# EasyEDA schematic SCH_数字时钟_2022-10-11.json
TITLE: Sheet_1; REV: 1.0; Date: 2022-10-07; Sheet: 1/1; Drawn By: 12sfdsg; Company: Your Company
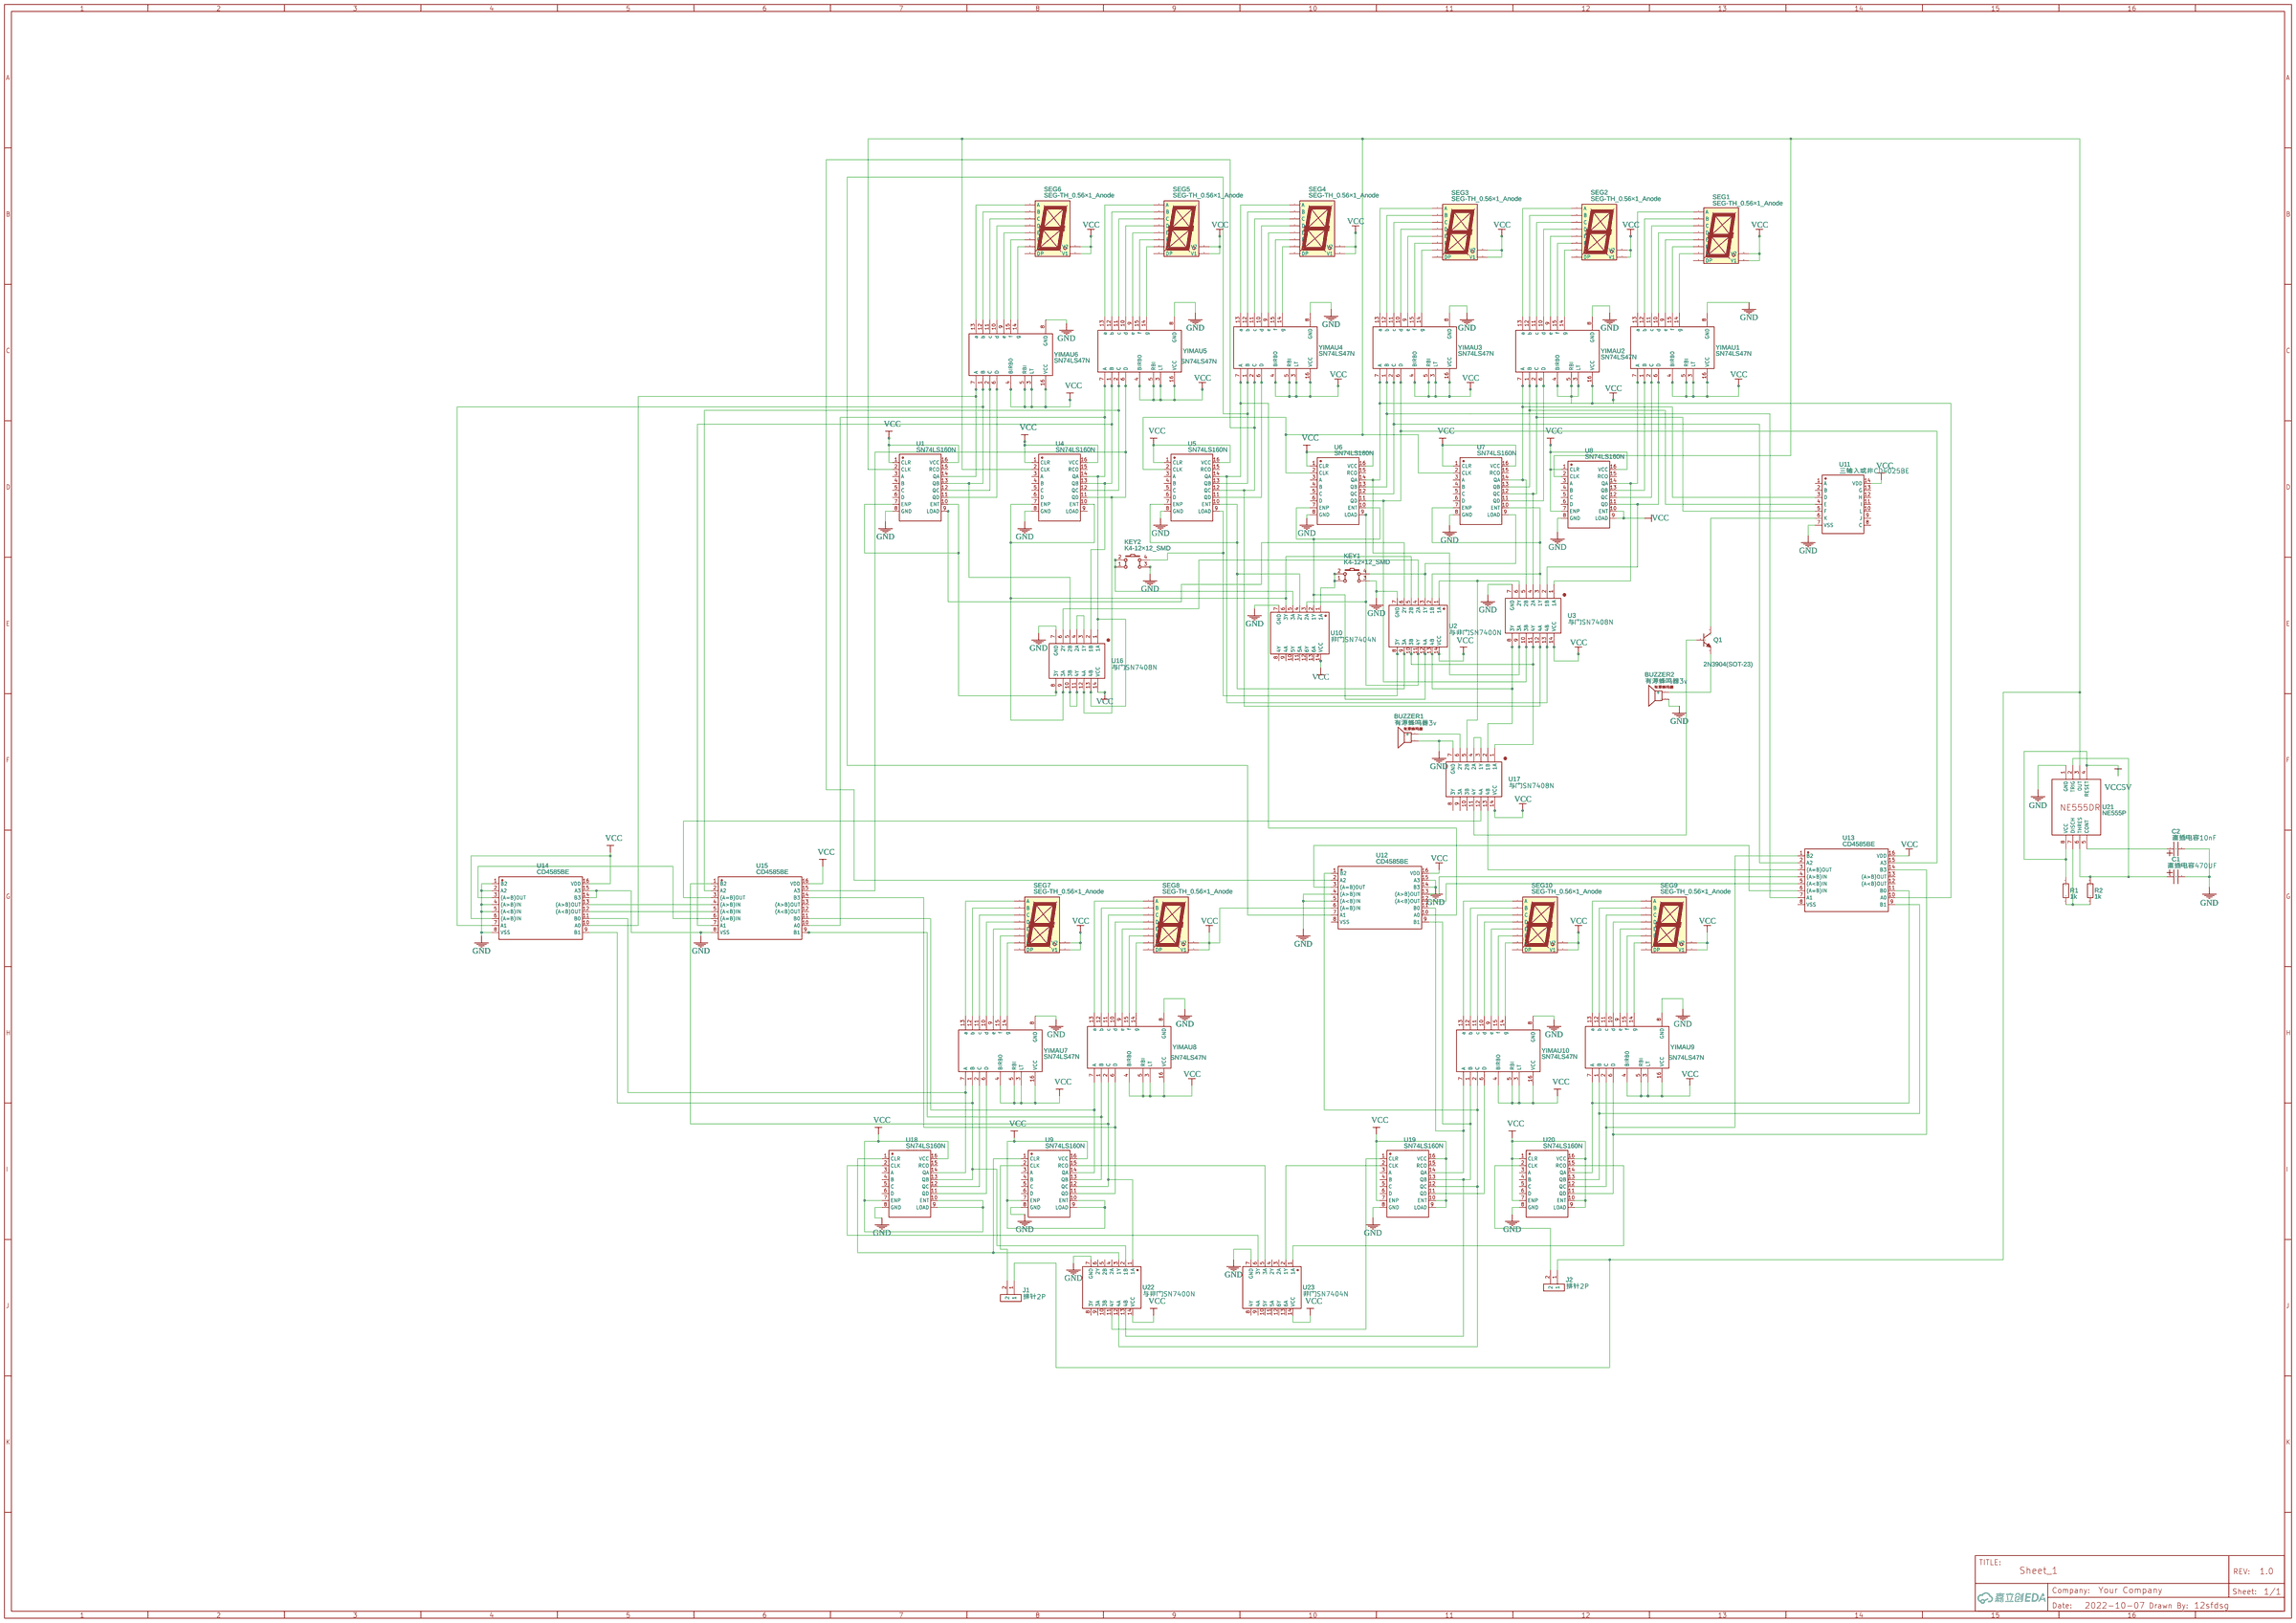
[diagram p0: schematic sheet]

## Parts
BUZZER1  有源蜂鸣器3v  [有源蜂鸣器3V]
BUZZER2  有源蜂鸣器3v  [有源蜂鸣器3V]
C1  直插电容470UF  [直插电容470UF]
C2  直插电容10nF  [直插电容470UF]
J1  排针2P  [排针2P]
J2  排针2P  [排针2P]
KEY1  K4-12×12_SMD  [KEY-SMD_4P-L12.0-W12.0-P5.00-LS15.2]
KEY2  K4-12×12_SMD  [KEY-SMD_4P-L12.0-W12.0-P5.00-LS15.2]
Q1  2N3904(SOT-23)  [SOT-23-3_L2.9-W1.3-P1.90-LS2.4-TR]
R1  1k  [直插电阻]
R2  1k  [直插电阻]
SEG1  SEG-TH_0.56×1_Anode  [LED-SEG-TH_10P-L12.6-W19.0-P2.54-S15.24-BL]
SEG2  SEG-TH_0.56×1_Anode  [LED-SEG-TH_10P-L12.6-W19.0-P2.54-S15.24-BL]
SEG3  SEG-TH_0.56×1_Anode  [LED-SEG-TH_10P-L12.6-W19.0-P2.54-S15.24-BL]
SEG4  SEG-TH_0.56×1_Anode  [LED-SEG-TH_10P-L12.6-W19.0-P2.54-S15.24-BL]
SEG5  SEG-TH_0.56×1_Anode  [LED-SEG-TH_10P-L12.6-W19.0-P2.54-S15.24-BL]
SEG6  SEG-TH_0.56×1_Anode  [LED-SEG-TH_10P-L12.6-W19.0-P2.54-S15.24-BL]
SEG7  SEG-TH_0.56×1_Anode  [LED-SEG-TH_10P-L12.6-W19.0-P2.54-S15.24-BL]
SEG8  SEG-TH_0.56×1_Anode  [LED-SEG-TH_10P-L12.6-W19.0-P2.54-S15.24-BL]
SEG9  SEG-TH_0.56×1_Anode  [LED-SEG-TH_10P-L12.6-W19.0-P2.54-S15.24-BL]
SEG10  SEG-TH_0.56×1_Anode  [LED-SEG-TH_10P-L12.6-W19.0-P2.54-S15.24-BL]
U1  SN74LS160N  [DIP-16]
U2  与非门SN7400N  [DIP14]
U3  与门SN7408N  [DIP14]
U4  SN74LS160N  [DIP-16]
U5  SN74LS160N  [DIP-16]
U6  SN74LS160N  [DIP-16]
U7  SN74LS160N  [DIP-16]
U8  SN74LS160N  [DIP-16]
U9  SN74LS160N  [DIP-16]
U10  非门SN7404N  [DIP14]
U11  三输入或非CD4025BE  [DIP-14_L19.2-W6.6-P2.54-LS10.9-BL]
U12  CD4585BE  [DIP-16_L20.0-W6.4-P2.54-LS7.6-BL]
U13  CD4585BE  [DIP-16_L20.0-W6.4-P2.54-LS7.6-BL]
U14  CD4585BE  [DIP-16_L20.0-W6.4-P2.54-LS7.6-BL]
U15  CD4585BE  [DIP-16_L20.0-W6.4-P2.54-LS7.6-BL]
U16  与门SN7408N  [DIP14]
U17  与门SN7408N  [DIP14]
U18  SN74LS160N  [DIP-16]
U19  SN74LS160N  [DIP-16]
U20  SN74LS160N  [DIP-16]
U21  NE555P  [NE555定时器]
U22  与非门SN7400N  [DIP14]
U23  非门SN7404N  [DIP14]
YIMAU1  SN74LS47N  [DIP-16]
YIMAU2  SN74LS47N  [DIP-16]
YIMAU3  SN74LS47N  [DIP-16]
YIMAU4  SN74LS47N  [DIP-16]
YIMAU5  SN74LS47N  [DIP-16]
YIMAU6  SN74LS47N  [DIP-16]
YIMAU7  SN74LS47N  [DIP-16]
YIMAU8  SN74LS47N  [DIP-16]
YIMAU9  SN74LS47N  [DIP-16]
YIMAU10  SN74LS47N  [DIP-16]

## Library data of the parts
BUZZER1 BUZZER2 = 有源蜂鸣器3v: Supplier: LCSC; Manufacturer: HNDZ; Manufacturer Part: TMB12A12; Supplier Part: C96079; Contributor: yibeikele
C1 C2 = 直插电容470UF: Contributor: 2021X
J1 J2 = 排针2P: Contributor: goodhello
KEY1 KEY2 = K4-12×12_SMD: Supplier Part: C136697; Supplier: LCSC; Manufacturer: 韩国韩荣; Manufacturer Part: K2-1103SP-E4SW-04; Contributor: LCEDA_Lib
Q1 = 2N3904(SOT-23): Supplier: LCSC; Manufacturer: KEC; Manufacturer Part: 2n3904S-RTK/PS; Supplier Part: C18536; Paste Type: SOT-23; Contributor: LCEDA_Lib
R1 R2 = 直插电阻: Supplier: LCSC; Manufacturer: UniOhm; Manufacturer Part: CFR0W4J0681A50; Supplier Part: C70784; Contributor: cy1811511104
SEG1-SEG10 = SEG-TH_0.56×1_Anode: Manufacturer: 志浩; Supplier Part: C8092; Supplier: LCSC; Contributor: LCEDA_01
U1 U4-U9 U18-U20 = SN74LS160N: Supplier: LCSC; Supplier Part: C113834; Manufacturer: YAGEO; Manufacturer Part: CC0805JRNPO9BN821; Contributor: LCSC
U2 U22 = SN7400N: Contributor: sky1001
U3 U16 U17 = SN7408N: Contributor: cdea
U10 U23 = SN7404N
U11 = CD4025BE: Supplier: LCSC; Manufacturer: TI; Supplier Part: C28214; JLCPCB Part Class: Extended Part
U12-U15 = CD4585BE: Supplier: LCSC; Manufacturer: TI; Supplier Part: C31466; JLCPCB Part Class: Extended Part
U21 = NE555P: Contributor: lzhlzh0805
YIMAU1-YIMAU10 = -: Supplier: LCSC; Manufacturer: TI; Contributor: LCSC; Supplier Part: C129379

## Nets
GND: BUZZER1.- BUZZER2.- C1.2 C2.2 KEY1.3 KEY2.3 U1.8(GND) U2.7(GND) U3.7(GND) U4.8(GND) U5.8(GND) U6.8(GND) U7.8(GND) U8.8(GND) U9.8(GND) U10.7(GND) U11.7(VSS) U12.4((A>B)IN) U12.5((A<B)IN) U12.14(B3) U12.15(A3) U14.1(B2) U14.2(A2) U14.4((A>B)IN) U14.5((A<B)IN) U14.8(VSS) U14.14(B3) U14.15(A3) U15.8(VSS) U16.7(GND) U17.7(GND) U18.8(GND) U19.8(GND) U20.8(GND) U21.1(GND) U22.7(GND) U23.7(GND) YIMAU1.8(GND) YIMAU2.8(GND) YIMAU3.8(GND) YIMAU4.8(GND) YIMAU5.8(GND) YIMAU6.8(GND) YIMAU7.8(GND) YIMAU8.8(GND) YIMAU9.8(GND) YIMAU10.8(GND)
VCC: SEG1.3(V1) SEG1.8(V2) SEG2.3(V1) SEG2.8(V2) SEG3.3(V1) SEG3.8(V2) SEG4.3(V1) SEG4.8(V2) SEG5.3(V1) SEG5.8(V2) SEG6.3(V1) SEG6.8(V2) SEG7.3(V1) SEG7.8(V2) SEG8.3(V1) SEG8.8(V2) SEG9.3(V1) SEG9.8(V2) SEG10.3(V1) SEG10.8(V2) U1.1(CLR) U1.16(VCC) U2.14(VCC) U3.9(3A) U3.14(VCC) U4.1(CLR) U4.16(VCC) U5.1(CLR) U5.16(VCC) U6.1(CLR) U6.14(QA) U6.16(VCC) U7.1(CLR) U7.16(VCC) U8.1(CLR) U8.7(ENP) U8.9(LOAD) U8.10(ENT) U8.16(VCC) U9.7(ENP) U9.9(LOAD) U9.10(ENT) U9.16(VCC) U10.14(VCC) U11.14(VDD) U12.6((A=B)IN) U12.16(VDD) U13.10(A0) U13.16(VDD) U14.6((A=B)IN) U14.16(VDD) U15.16(VDD) U16.14(VCC) U17.14(VCC) U18.7(ENP) U18.9(LOAD) U18.10(ENT) U18.16(VCC) U19.7(ENP) U19.9(LOAD) U19.10(ENT) U19.16(VCC) U20.1(CLR) U20.7(ENP) U20.9(LOAD) U20.10(ENT) U20.16(VCC) U22.14(VCC) U23.14(VCC) YIMAU1.3(LT) YIMAU1.4(BIRBO) YIMAU1.5(RBI) YIMAU1.16(VCC) YIMAU2.3(LT) YIMAU2.4(BIRBO) YIMAU2.5(RBI) YIMAU2.16(VCC) YIMAU3.3(LT) YIMAU3.4(BIRBO) YIMAU3.5(RBI) YIMAU3.7(A) YIMAU3.16(VCC) YIMAU4.3(LT) YIMAU4.4(BIRBO) YIMAU4.5(RBI) YIMAU4.16(VCC) YIMAU5.3(LT) YIMAU5.4(BIRBO) YIMAU5.5(RBI) YIMAU5.16(VCC) YIMAU6.3(LT) YIMAU6.4(BIRBO) YIMAU6.5(RBI) YIMAU6.16(VCC) YIMAU7.3(LT) YIMAU7.4(BIRBO) YIMAU7.5(RBI) YIMAU7.16(VCC) YIMAU8.3(LT) YIMAU8.4(BIRBO) YIMAU8.5(RBI) YIMAU8.16(VCC) YIMAU9.3(LT) YIMAU9.4(BIRBO) YIMAU9.5(RBI) YIMAU9.16(VCC) YIMAU10.3(LT) YIMAU10.4(BIRBO) YIMAU10.5(RBI) YIMAU10.16(VCC)
VCC5V: R1.2 U21.4(RESET) U21.8(VCC)
Net-(BUZZER1-+): BUZZER1.+ U17.6(2Y)
Net-(BUZZER2-+): BUZZER2.+ Q1.1(E)
Net-(C1-1): C1.1 R2.2 U21.2(TRIG) U21.6(THRES)
Net-(C2-1): C2.1 U21.5(CONT)
Net-(J1-1): J1.1 J2.1 U1.2(CLK) U4.2(CLK) U5.2(CLK) U6.2(CLK) U7.2(CLK) U8.2(CLK) U21.3(OUT)
Net-(J1-2): J1.2 U9.2(CLK)
Net-(J2-2): J2.2 U20.2(CLK)
Net-(KEY1-1): KEY1.1 KEY1.2 U10.1(1A)
Net-(KEY1-4): KEY1.4 U2.3(1Y) U7.9(LOAD)
Net-(KEY2-1): KEY2.1 KEY2.2 U10.5(3A)
Net-(KEY2-4): KEY2.4 U2.8(3Y) U5.9(LOAD)
Net-(Q1-2): Q1.2(B) U17.11(4Y)
Net-(Q1-3): Q1.3(C) U11.6(K)
Net-(R1-1): R1.1 R2.1 U21.7(DISCH)
Net-(SEG1-1): SEG1.1(E) YIMAU1.9(e)
Net-(SEG1-2): SEG1.2(D) YIMAU1.10(d)
Net-(SEG1-4): SEG1.4(C) YIMAU1.11(c)
Net-(SEG1-6): SEG1.6(B) YIMAU1.12(b)
Net-(SEG1-7): SEG1.7(A) YIMAU1.13(a)
Net-(SEG1-9): SEG1.9(F) YIMAU1.15(f)
Net-(SEG1-10): SEG1.10(G) YIMAU1.14(g)
Net-(SEG2-1): SEG2.1(E) YIMAU2.9(e)
Net-(SEG2-2): SEG2.2(D) YIMAU2.10(d)
Net-(SEG2-4): SEG2.4(C) YIMAU2.11(c)
Net-(SEG2-6): SEG2.6(B) YIMAU2.12(b)
Net-(SEG2-7): SEG2.7(A) YIMAU2.13(a)
Net-(SEG2-9): SEG2.9(F) YIMAU2.15(f)
Net-(SEG2-10): SEG2.10(G) YIMAU2.14(g)
Net-(SEG3-1): SEG3.1(E) YIMAU3.9(e)
Net-(SEG3-2): SEG3.2(D) YIMAU3.10(d)
Net-(SEG3-4): SEG3.4(C) YIMAU3.11(c)
Net-(SEG3-6): SEG3.6(B) YIMAU3.12(b)
Net-(SEG3-7): SEG3.7(A) YIMAU3.13(a)
Net-(SEG3-9): SEG3.9(F) YIMAU3.15(f)
Net-(SEG3-10): SEG3.10(G) YIMAU3.14(g)
Net-(SEG4-1): SEG4.1(E) YIMAU4.9(e)
Net-(SEG4-2): SEG4.2(D) YIMAU4.10(d)
Net-(SEG4-4): SEG4.4(C) YIMAU4.11(c)
Net-(SEG4-6): SEG4.6(B) YIMAU4.12(b)
Net-(SEG4-7): SEG4.7(A) YIMAU4.13(a)
Net-(SEG4-9): SEG4.9(F) YIMAU4.15(f)
Net-(SEG4-10): SEG4.10(G) YIMAU4.14(g)
Net-(SEG5-1): SEG5.1(E) YIMAU5.9(e)
Net-(SEG5-2): SEG5.2(D) YIMAU5.10(d)
Net-(SEG5-4): SEG5.4(C) YIMAU5.11(c)
Net-(SEG5-6): SEG5.6(B) YIMAU5.12(b)
Net-(SEG5-7): SEG5.7(A) YIMAU5.13(a)
Net-(SEG5-9): SEG5.9(F) YIMAU5.15(f)
Net-(SEG5-10): SEG5.10(G) YIMAU5.14(g)
Net-(SEG6-1): SEG6.1(E) YIMAU6.9(e)
Net-(SEG6-2): SEG6.2(D) YIMAU6.10(d)
Net-(SEG6-4): SEG6.4(C) YIMAU6.11(c)
Net-(SEG6-6): SEG6.6(B) YIMAU6.12(b)
Net-(SEG6-7): SEG6.7(A) YIMAU6.13(a)
Net-(SEG6-9): SEG6.9(F) YIMAU6.15(f)
Net-(SEG6-10): SEG6.10(G) YIMAU6.14(g)
Net-(SEG7-1): SEG7.1(E) YIMAU7.9(e)
Net-(SEG7-2): SEG7.2(D) YIMAU7.10(d)
Net-(SEG7-4): SEG7.4(C) YIMAU7.11(c)
Net-(SEG7-6): SEG7.6(B) YIMAU7.12(b)
Net-(SEG7-7): SEG7.7(A) YIMAU7.13(a)
Net-(SEG7-9): SEG7.9(F) YIMAU7.15(f)
Net-(SEG7-10): SEG7.10(G) YIMAU7.14(g)
Net-(SEG8-1): SEG8.1(E) YIMAU8.9(e)
Net-(SEG8-2): SEG8.2(D) YIMAU8.10(d)
Net-(SEG8-4): SEG8.4(C) YIMAU8.11(c)
Net-(SEG8-6): SEG8.6(B) YIMAU8.12(b)
Net-(SEG8-7): SEG8.7(A) YIMAU8.13(a)
Net-(SEG8-9): SEG8.9(F) YIMAU8.15(f)
Net-(SEG8-10): SEG8.10(G) YIMAU8.14(g)
Net-(SEG9-1): SEG9.1(E) YIMAU9.9(e)
Net-(SEG9-2): SEG9.2(D) YIMAU9.10(d)
Net-(SEG9-4): SEG9.4(C) YIMAU9.11(c)
Net-(SEG9-6): SEG9.6(B) YIMAU9.12(b)
Net-(SEG9-7): SEG9.7(A) YIMAU9.13(a)
Net-(SEG9-9): SEG9.9(F) YIMAU9.15(f)
Net-(SEG9-10): SEG9.10(G) YIMAU9.14(g)
Net-(SEG10-1): SEG10.1(E) YIMAU10.9(e)
Net-(SEG10-2): SEG10.2(D) YIMAU10.10(d)
Net-(SEG10-4): SEG10.4(C) YIMAU10.11(c)
Net-(SEG10-6): SEG10.6(B) YIMAU10.12(b)
Net-(SEG10-7): SEG10.7(A) YIMAU10.13(a)
Net-(SEG10-9): SEG10.9(F) YIMAU10.15(f)
Net-(SEG10-10): SEG10.10(G) YIMAU10.14(g)
Net-(U1-7): U1.7(ENP) U1.10(ENT) U16.8(3Y)
Net-(U1-9): U1.9(LOAD) U2.6(2Y)
Net-(U1-11): U1.11(QD) YIMAU6.6(D)
Net-(U1-12): U1.12(QC) YIMAU6.2(C)
Net-(U1-13): U1.13(QB) U14.7(A1) U16.5(2B) YIMAU6.1(B)
Net-(U1-14): U1.14(QA) U14.10(A0) YIMAU6.7(A)
Net-(U2-1): U2.1(1A) U3.6(2Y) U17.5(2B)
Net-(U2-2): U2.2(1B) U3.3(1Y) U7.7(ENP) U7.10(ENT)
Net-(U2-4): U2.4(2A) U16.6(2Y)
Net-(U2-5): U2.5(2B) U4.7(ENP) U4.10(ENT) U10.6(3Y) U16.9(3A)
Net-(U2-9): U2.9(3A) U5.7(ENP) U5.10(ENT) U10.4(2Y)
Net-(U2-10): U2.10(3B) U3.11(4Y) U17.1(1A)
Net-(U2-11): U2.11(4Y) U6.9(LOAD) U10.3(2A)
Net-(U2-12): U2.12(4A) U6.7(ENP) U6.10(ENT) U10.2(1Y)
Net-(U2-13): U2.13(4B) U3.8(3Y) U17.2(1B)
Net-(U3-1): U3.1(1A) U8.14(QA) YIMAU1.7(A)
Net-(U3-2): U3.2(1B) U8.11(QD) YIMAU1.6(D)
Net-(U3-4): U3.4(2A) U7.12(QC) U11.5(F) YIMAU2.2(C)
Net-(U3-5): U3.5(2B) U7.14(QA) U11.3(D) YIMAU2.7(A)
Net-(U3-10): U3.10(3B) U6.11(QD) U13.15(A3) YIMAU3.6(D)
Net-(U3-12): U3.12(4A) U5.12(QC) U12.2(A2) YIMAU4.2(C)
Net-(U3-13): U3.13(4B) U5.14(QA) U12.10(A0) YIMAU4.7(A)
Net-(U4-11): U4.11(QD) U15.15(A3) U16.12(4A) YIMAU5.6(D)
Net-(U4-12): U4.12(QC) U15.2(A2) YIMAU5.2(C)
Net-(U4-13): U4.13(QB) U15.7(A1) U16.2(1B) YIMAU5.1(B)
Net-(U4-14): U4.14(QA) U15.10(A0) U16.1(1A) U16.13(4B) YIMAU5.7(A)
Net-(U5-11): U5.11(QD) YIMAU4.6(D)
Net-(U5-13): U5.13(QB) U12.7(A1) YIMAU4.1(B)
Net-(U6-12): U6.12(QC) U13.2(A2) YIMAU3.2(C)
Net-(U6-13): U6.13(QB) U13.7(A1) YIMAU3.1(B)
Net-(U7-11): U7.11(QD) YIMAU2.6(D)
Net-(U7-13): U7.13(QB) U11.4(E) YIMAU2.1(B)
Net-(U8-12): U8.12(QC) YIMAU1.2(C)
Net-(U8-13): U8.13(QB) YIMAU1.1(B)
Net-(U9-1): U9.1(CLR) U18.1(CLR) U22.3(1Y)
Net-(U9-11): U9.11(QD) U15.14(B3) YIMAU8.6(D)
Net-(U9-12): U9.12(QC) U15.1(B2) U22.1(1A) YIMAU8.2(C)
Net-(U9-13): U9.13(QB) U15.9(B1) YIMAU8.1(B)
Net-(U9-14): U9.14(QA) U15.11(B0) YIMAU8.7(A)
Net-(U9-15): U9.15(RCO) U23.5(3A)
Net-(U12-1): U12.1(B2) U19.12(QC) U22.12(4A) YIMAU10.2(C)
Net-(U12-3): U12.3((A=B)OUT) U13.6((A=B)IN)
Net-(U12-9): U12.9(B1) U19.13(QB) U22.13(4B) YIMAU10.1(B)
Net-(U12-11): U12.11(B0) U19.14(QA) YIMAU10.7(A)
Net-(U12-12): U12.12((A<B)OUT) U13.5((A<B)IN)
Net-(U12-13): U12.13((A>B)OUT) U13.4((A>B)IN)
Net-(U13-1): U13.1(B2) U20.12(QC) YIMAU9.2(C)
Net-(U13-3): U13.3((A=B)OUT) U17.13(4B)
Net-(U13-9): U13.9(B1) U20.13(QB) YIMAU9.1(B)
Net-(U13-11): U13.11(B0) U20.14(QA) YIMAU9.7(A)
Net-(U13-14): U13.14(B3) U20.11(QD) YIMAU9.6(D)
Net-(U14-3): U14.3((A=B)OUT) U15.6((A=B)IN)
Net-(U14-9): U14.9(B1) U18.13(QB) U22.2(1B) YIMAU7.1(B)
Net-(U14-11): U14.11(B0) U18.14(QA) YIMAU7.7(A)
Net-(U14-12): U14.12((A<B)OUT) U15.5((A<B)IN)
Net-(U14-13): U14.13((A>B)OUT) U15.4((A>B)IN)
Net-(U15-3): U15.3((A=B)OUT) U17.12(4A)
Net-(U16-3): U16.3(1Y) U16.4(2A)
Net-(U16-10): U16.10(3B) U16.11(4Y)
Net-(U17-3): U17.3(1Y) U17.4(2A)
Net-(U18-2): U18.2(CLK) U23.6(3Y)
Net-(U18-11): U18.11(QD) YIMAU7.6(D)
Net-(U18-12): U18.12(QC) YIMAU7.2(C)
Net-(U19-1): U19.1(CLR) U22.11(4Y)
Net-(U19-2): U19.2(CLK) U23.2(1Y)
Net-(U19-11): U19.11(QD) YIMAU10.6(D)
Net-(U20-15): U20.15(RCO) U23.1(1A)

Not connected (* = marked no-connect by the designer): SEG1 5(DP); SEG2 5(DP); SEG3 5(DP); SEG4 5(DP); SEG5 5(DP); SEG6 5(DP); SEG7 5(DP); SEG8 5(DP); SEG9 5(DP); SEG10 5(DP); U1 3(A) 4(B) 5(C) 6(D) 15(RCO); U4 3(A) 4(B) 5(C) 6(D) 9(LOAD) 15(RCO); U5 3(A) 4(B) 5(C) 6(D) 15(RCO); U6 3(A) 4(B) 5(C) 6(D) 15(RCO); U7 3(A) 4(B) 5(C) 6(D) 15(RCO); U8 3(A) 4(B) 5(C) 6(D) 15(RCO); U9 3(A) 4(B) 5(C) 6(D); U10 8(4Y) 9(4A) 10(5Y) 11(5A) 12(6Y) 13(6A); U11 1(A) 2(B) 8(C) 9(J) 10(L) 11(I) 12(H) 13(G); U12 8(VSS); U13 8(VSS) 12((A<B)OUT) 13((A>B)OUT); U15 12((A<B)OUT) 13((A>B)OUT); U17 8(3Y) 9(3A) 10(3B); U18 3(A) 4(B) 5(C) 6(D) 15(RCO); U19 3(A) 4(B) 5(C) 6(D) 15(RCO); U20 3(A) 4(B) 5(C) 6(D); U22 4(2A) 5(2B) 6(2Y) 8(3Y) 9(3A) 10(3B); U23 3(2A) 4(2Y) 8(4Y) 9(4A) 10(5Y) 11(5A) 12(6Y) 13(6A)
